# EAGLE schematic SPEEDUINO_WATERPROOF_TC_TRAC (EAGLE 9.1.3)

## Sheet 1 of 7
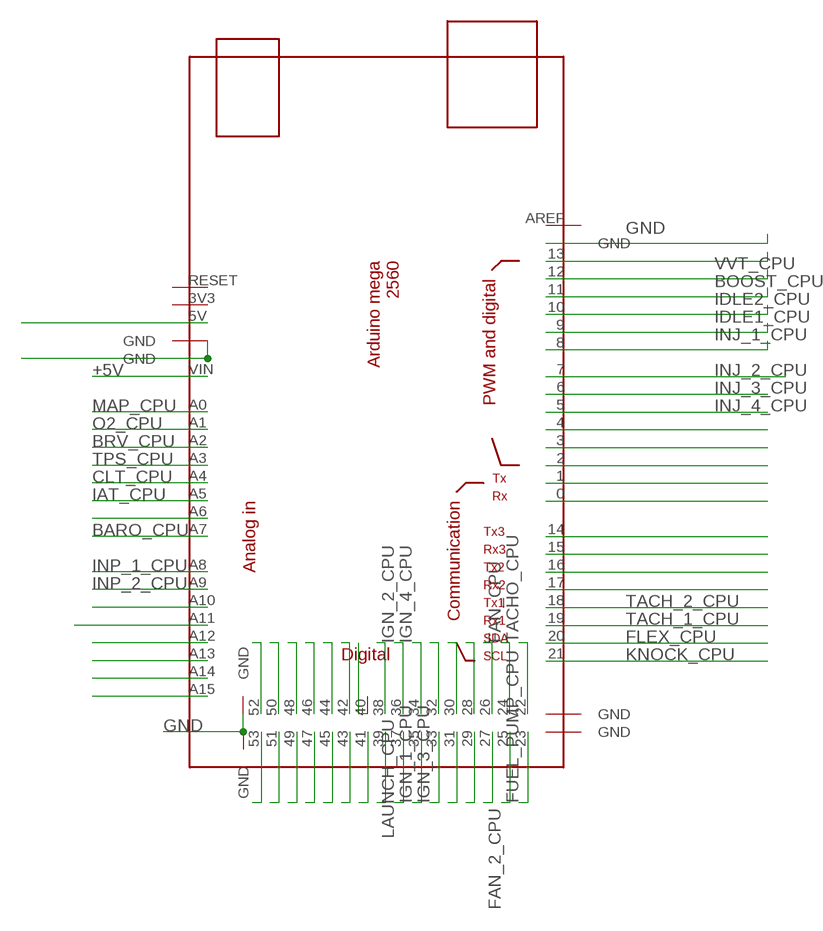
[diagram p0: schematic, sheet 1]

### Parts
U$1  MEGA_DEVICE  [MEGAOUTLINE]

### Nets
+5V: U$1.VIN ; also sheet 2,3,4,5,6
BARO_CPU: U$1.A7
BOOST_CPU: U$1.12 ; also sheet 3
BRV_CPU: U$1.A2 ; also sheet 2
CLT_CPU: U$1.A4 ; also sheet 2,6
FAN_2_CPU: U$1.25 ; also sheet 3
FAN_CPU: U$1.24 ; also sheet 3
FLEX_CPU: U$1.20 ; also sheet 2
FUEL_PUMP_CPU: U$1.23 ; also sheet 3
GND: U$1.GND@1(GND) U$1.GND@6(GND) U$1.GND@7(GND) ; also sheet 2,3,4,5,6
IAT_CPU: U$1.A5 ; also sheet 2
IDLE1_CPU: U$1.9 ; also sheet 3
IDLE2_CPU: U$1.10 ; also sheet 3
IGN_1_CPU: U$1.35 ; also sheet 3
IGN_2_CPU: U$1.36 ; also sheet 3
IGN_3_CPU: U$1.33 ; also sheet 3
IGN_4_CPU: U$1.34 ; also sheet 3
INJ_1_CPU: U$1.8 ; also sheet 3
INJ_2_CPU: U$1.7 ; also sheet 3
INJ_3_CPU: U$1.6 ; also sheet 3
INJ_4_CPU: U$1.5 ; also sheet 3
INP_1_CPU: U$1.A8
INP_2_CPU: U$1.A9 ; also sheet 2
KNOCK_CPU: U$1.21 ; also sheet 2
LAUNCH_CPU: U$1.37 ; also sheet 2
MAP_CPU: U$1.A0 ; also sheet 2,6
N$1: U$1.GND@2(GND) U$1.GND@3(GND)
N$2: U$1.5V
N$3: U$1.52
N$4: U$1.50
N$5: U$1.11
N$6: U$1.48
N$7: U$1.46
N$8: U$1.44
N$9: U$1.42
N$10: U$1.40
N$11: U$1.38
N$12: U$1.4
N$13: U$1.3
N$14: U$1.2
N$15: U$1.1
N$16: U$1.0
N$17: U$1.14
N$18: U$1.15
N$19: U$1.16
N$20: U$1.17
N$25: U$1.A15
N$26: U$1.A14
N$27: U$1.A13
N$28: U$1.A12
N$29: U$1.A11
N$30: U$1.A10
N$34: U$1.A6
N$44: U$1.32
N$45: U$1.30
N$46: U$1.28
N$47: U$1.26
N$50: U$1.53
N$51: U$1.51
N$52: U$1.49
N$53: U$1.47
N$54: U$1.45
N$55: U$1.43
N$56: U$1.41
N$57: U$1.39
N$61: U$1.31
N$62: U$1.29
N$63: U$1.27
O2_CPU: U$1.A1 ; also sheet 2
TACH_1_CPU: U$1.19 ; also sheet 3
TACH_2_CPU: U$1.18 ; also sheet 3
TACHO_CPU: U$1.22 ; also sheet 3,6
TPS_CPU: U$1.A3 ; also sheet 2,6
VVT_CPU: U$1.13 ; also sheet 3
Unconnected: U$1.3V3 U$1.AREF U$1.GND@4(GND) U$1.GND@5(GND) U$1.RESET

## Sheet 2 of 7
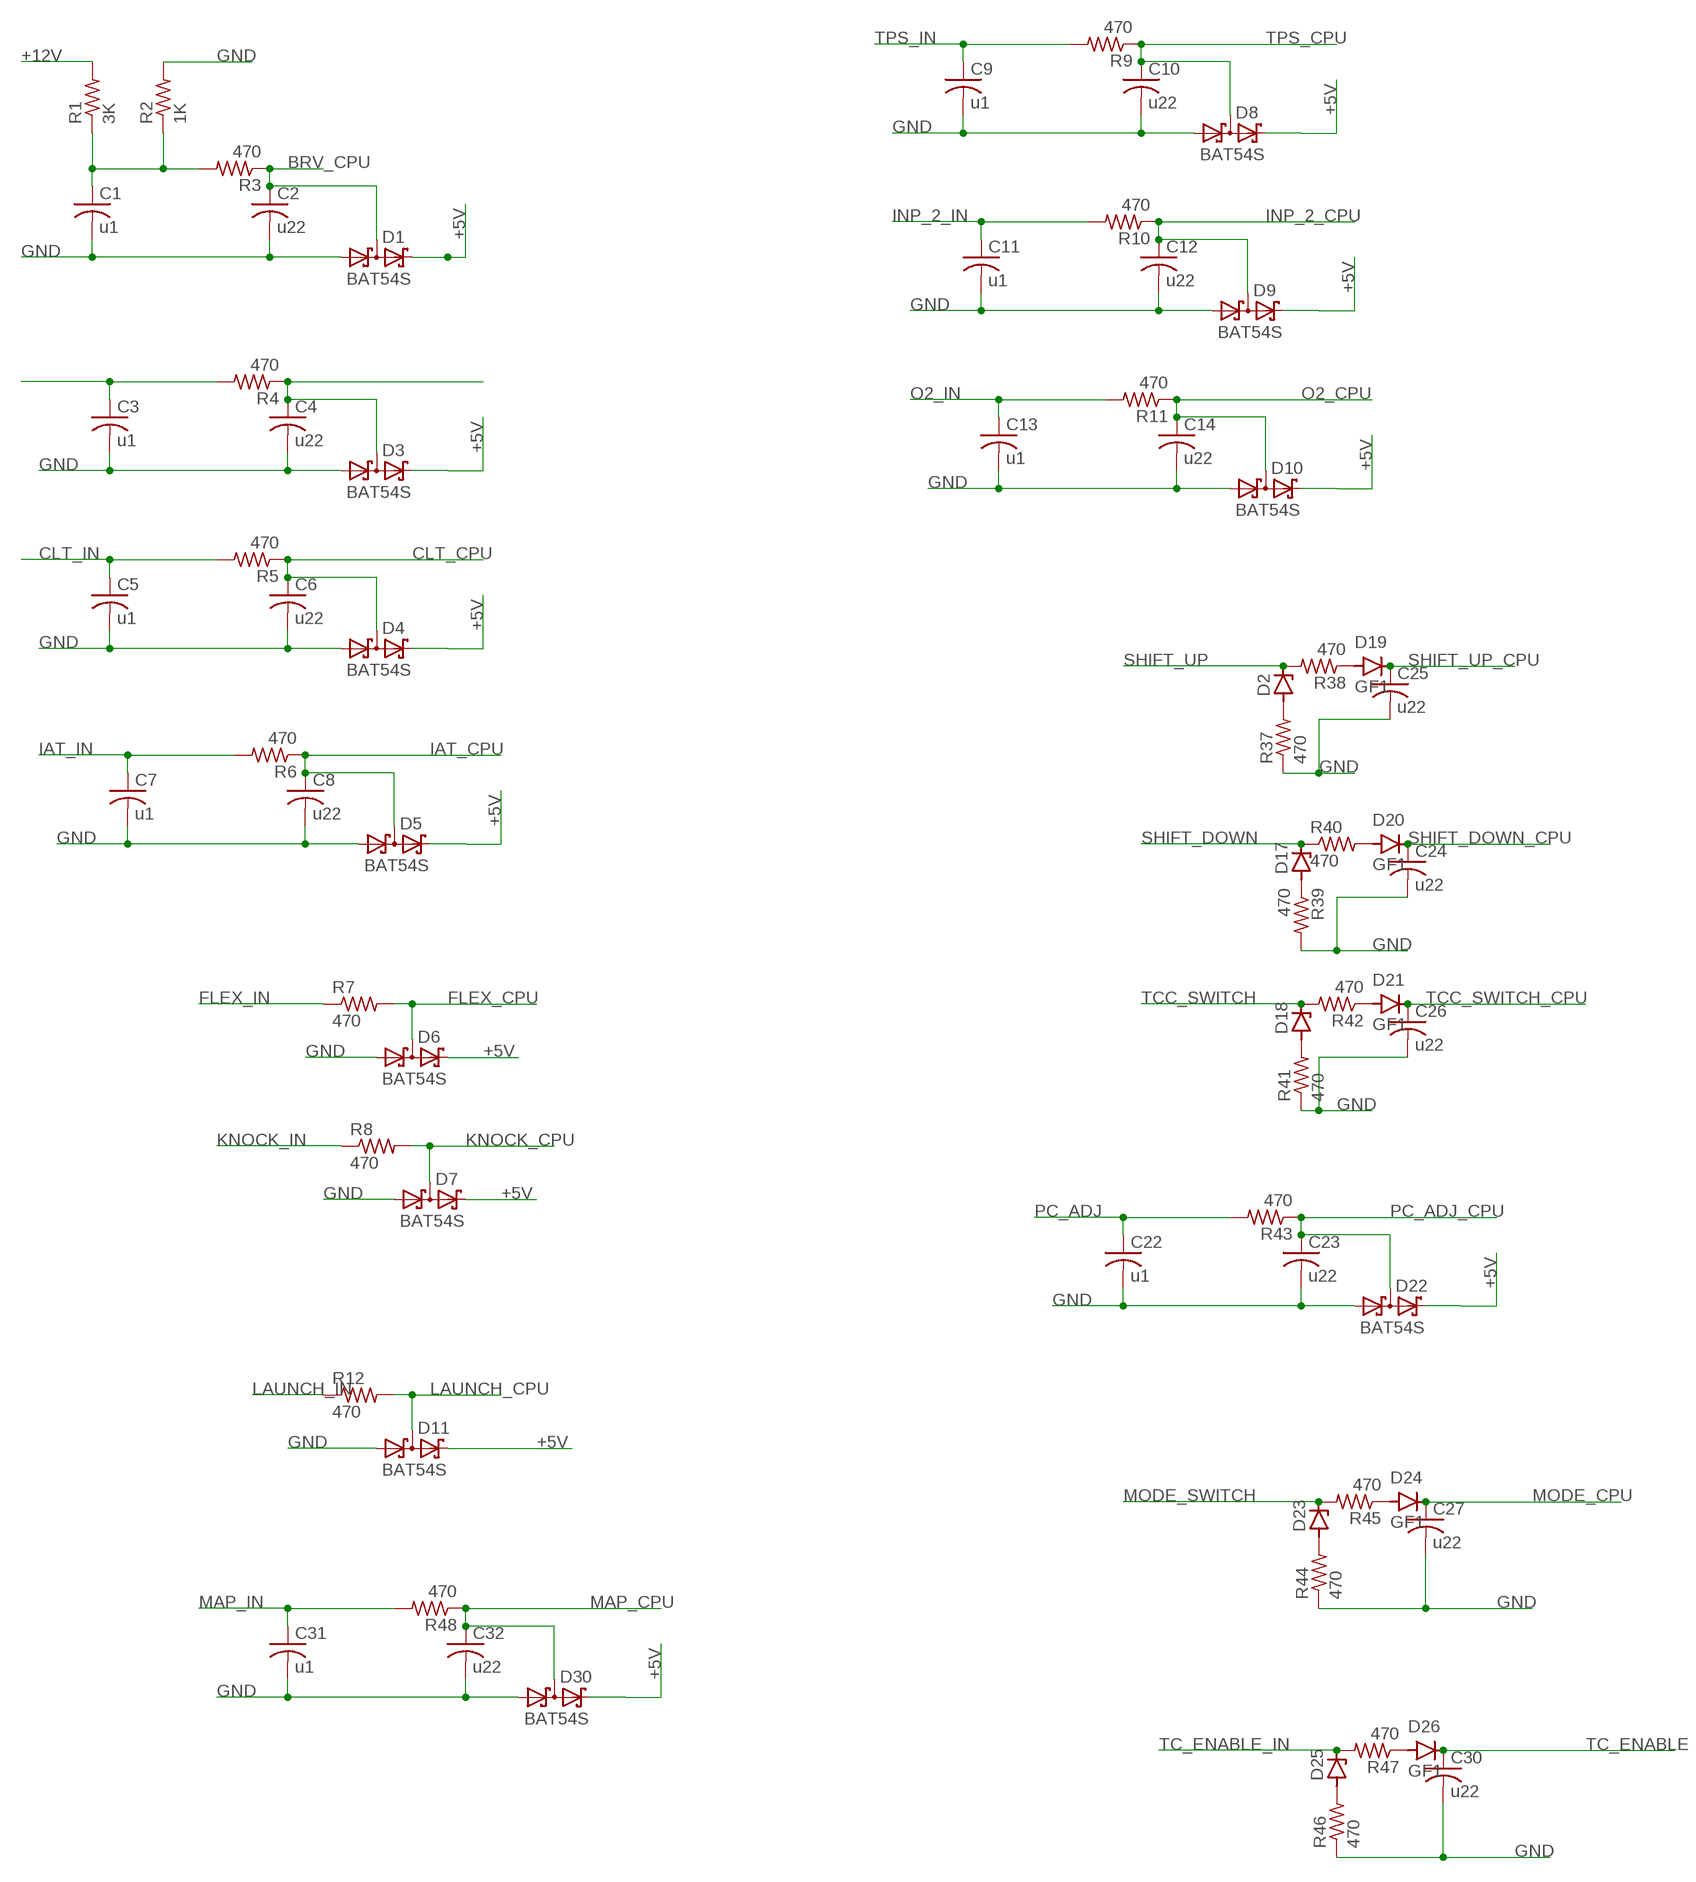
[diagram p1: schematic, sheet 2]

### Parts
C1  u1  C-USC0805  [C0805]
C2  u22  C-USC0805  [C0805]
C3  u1  C-USC0805  [C0805]
C4  u22  C-USC0805  [C0805]
C5  u1  C-USC0805  [C0805]
C6  u22  C-USC0805  [C0805]
C7  u1  C-USC0805  [C0805]
C8  u22  C-USC0805  [C0805]
C9  u1  C-USC0805  [C0805]
C10  u22  C-USC0805  [C0805]
C11  u1  C-USC0805  [C0805]
C12  u22  C-USC0805  [C0805]
C13  u1  C-USC0805  [C0805]
C14  u22  C-USC0805  [C0805]
C22  u1  C-USC0805  [C0805]
C23  u22  C-USC0805  [C0805]
C24  u22  C-USC0805  [C0805]
C25  u22  C-USC0805  [C0805]
C26  u22  C-USC0805  [C0805]
C27  u22  C-USC0805  [C0805]
C30  u22  C-USC0805  [C0805]
C31  u1  C-USC0805  [C0805]
C32  u22  C-USC0805  [C0805]
D1  BAT54S  [SOT23]
D2  ZENER-DIODESOT23  [SOT23]
D3  BAT54S  [SOT23]
D4  BAT54S  [SOT23]
D5  BAT54S  [SOT23]
D6  BAT54S  [SOT23]
D7  BAT54S  [SOT23]
D8  BAT54S  [SOT23]
D9  BAT54S  [SOT23]
D10  BAT54S  [SOT23]
D11  BAT54S  [SOT23]
D17  ZENER-DIODESOT23  [SOT23]
D18  ZENER-DIODESOT23  [SOT23]
D19  GF1  [SMA-DO214AC]
D20  GF1  [SMA-DO214AC]
D21  GF1  [SMA-DO214AC]
D22  BAT54S  [SOT23]
D23  ZENER-DIODESOT23  [SOT23]
D24  GF1  [SMA-DO214AC]
D25  ZENER-DIODESOT23  [SOT23]
D26  GF1  [SMA-DO214AC]
D30  BAT54S  [SOT23]
R1  3K  R-US_R0805  [R0805]
R2  1K  R-US_R0805  [R0805]
R3  470  R-US_R0805  [R0805]
R4  470  R-US_R0805  [R0805]
R5  470  R-US_R0805  [R0805]
R6  470  R-US_R0805  [R0805]
R7  470  R-US_R0603  [R0603]
R8  470  R-US_R0603  [R0603]
R9  470  R-US_R0805  [R0805]
R10  470  R-US_R0805  [R0805]
R11  470  R-US_R0805  [R0805]
R12  470  R-US_R0603  [R0603]
R37  470  R-US_R0805  [R0805]
R38  470  R-US_R0805  [R0805]
R39  470  R-US_R0805  [R0805]
R40  470  R-US_R0805  [R0805]
R41  470  R-US_R0805  [R0805]
R42  470  R-US_R0805  [R0805]
R43  470  R-US_R0805  [R0805]
R44  470  R-US_R0805  [R0805]
R45  470  R-US_R0805  [R0805]
R46  470  R-US_R0805  [R0805]
R47  470  R-US_R0805  [R0805]
R48  470  R-US_R0805  [R0805]

### Nets
+5V: D1.2(K2) D3.2(K2) D4.2(K2) D5.2(K2) D6.2(K2) D7.2(K2) D8.2(K2) D9.2(K2) D10.2(K2) D11.2(K2) D22.2(K2) D30.2(K2) ; also sheet 1,3,4,5,6
+12V: R1.2 ; also sheet 3,4,5
BRV_CPU: C2.1 D1.3(K1A2) R3.1 ; also sheet 1
CLT_CPU: C6.1 D4.3(K1A2) R5.1 ; also sheet 1,6
CLT_IN: C5.1 R5.2 ; also sheet 5
FLEX_CPU: D6.3(K1A2) R7.2 ; also sheet 1
FLEX_IN: R7.1 ; also sheet 5
GND: C1.2 C2.2 C3.2 C4.2 C5.2 C6.2 C7.2 C8.2 C9.2 C10.2 C11.2 C12.2 C13.2 C14.2 C22.2 C23.2 C24.2 C25.2 C26.2 C27.2 C30.2 C31.2 C32.2 D1.1(A1) D3.1(A1) D4.1(A1) D5.1(A1) D6.1(A1) D7.1(A1) D8.1(A1) D9.1(A1) D10.1(A1) D11.1(A1) D22.1(A1) D30.1(A1) R2.2 R37.1 R39.2 R41.1 R44.1 R46.1 ; also sheet 1,3,4,5,6
IAT_CPU: C8.1 D5.3(K1A2) R6.1 ; also sheet 1
IAT_IN: C7.1 R6.2 ; also sheet 5
INP_2_CPU: C12.1 D9.3(K1A2) R10.1 ; also sheet 1
INP_2_IN: C11.1 R10.2
KNOCK_CPU: D7.3(K1A2) R8.2 ; also sheet 1
KNOCK_IN: R8.1 ; also sheet 5,6
LAUNCH_CPU: D11.3(K1A2) R12.2 ; also sheet 1
LAUNCH_IN: R12.1 ; also sheet 5
MAP_CPU: C32.1 D30.3(K1A2) R48.1 ; also sheet 1,6
MAP_IN: C31.1 R48.2
MODE_CPU: C27.1 D24.K(C) ; also sheet 6
MODE_SWITCH: D23.3(C) R45.2 ; also sheet 5
N$21: C1.1 R1.1 R2.1 R3.2
N$22: C3.1 R4.2
N$23: C4.1 D3.3(K1A2) R4.1
N$49: D19.A R38.1
N$58: D2.1(A) R37.2
N$59: D17.1(A) R39.1
N$60: D23.1(A) R44.2
N$64: D25.1(A) R46.2
N$65: D20.A R40.2
N$66: D24.A R45.1
N$67: D18.1(A) R41.2
N$69: D26.A R47.1
N$71: D21.A R42.1
O2_CPU: C14.1 D10.3(K1A2) R11.1 ; also sheet 1
O2_IN: C13.1 R11.2 ; also sheet 5
PC_ADJ: C22.1 R43.2 ; also sheet 5
PC_ADJ_CPU: C23.1 D22.3(K1A2) R43.1 ; also sheet 6
SHIFT_DOWN: D17.3(C) R40.1 ; also sheet 5
SHIFT_DOWN_CPU: C24.1 D20.K(C) ; also sheet 6
SHIFT_UP: D2.3(C) R38.2 ; also sheet 5
SHIFT_UP_CPU: C25.1 D19.K(C) ; also sheet 6
TC_ENABLE: C30.1 D26.K(C) ; also sheet 6
TC_ENABLE_IN: D25.3(C) R47.2 ; also sheet 5
TCC_SWITCH: D18.3(C) R42.2 ; also sheet 5
TCC_SWITCH_CPU: C26.1 D21.K(C) ; also sheet 6
TPS_CPU: C10.1 D8.3(K1A2) R9.1 ; also sheet 1,6
TPS_IN: C9.1 R9.2 ; also sheet 5

## Sheet 3 of 7
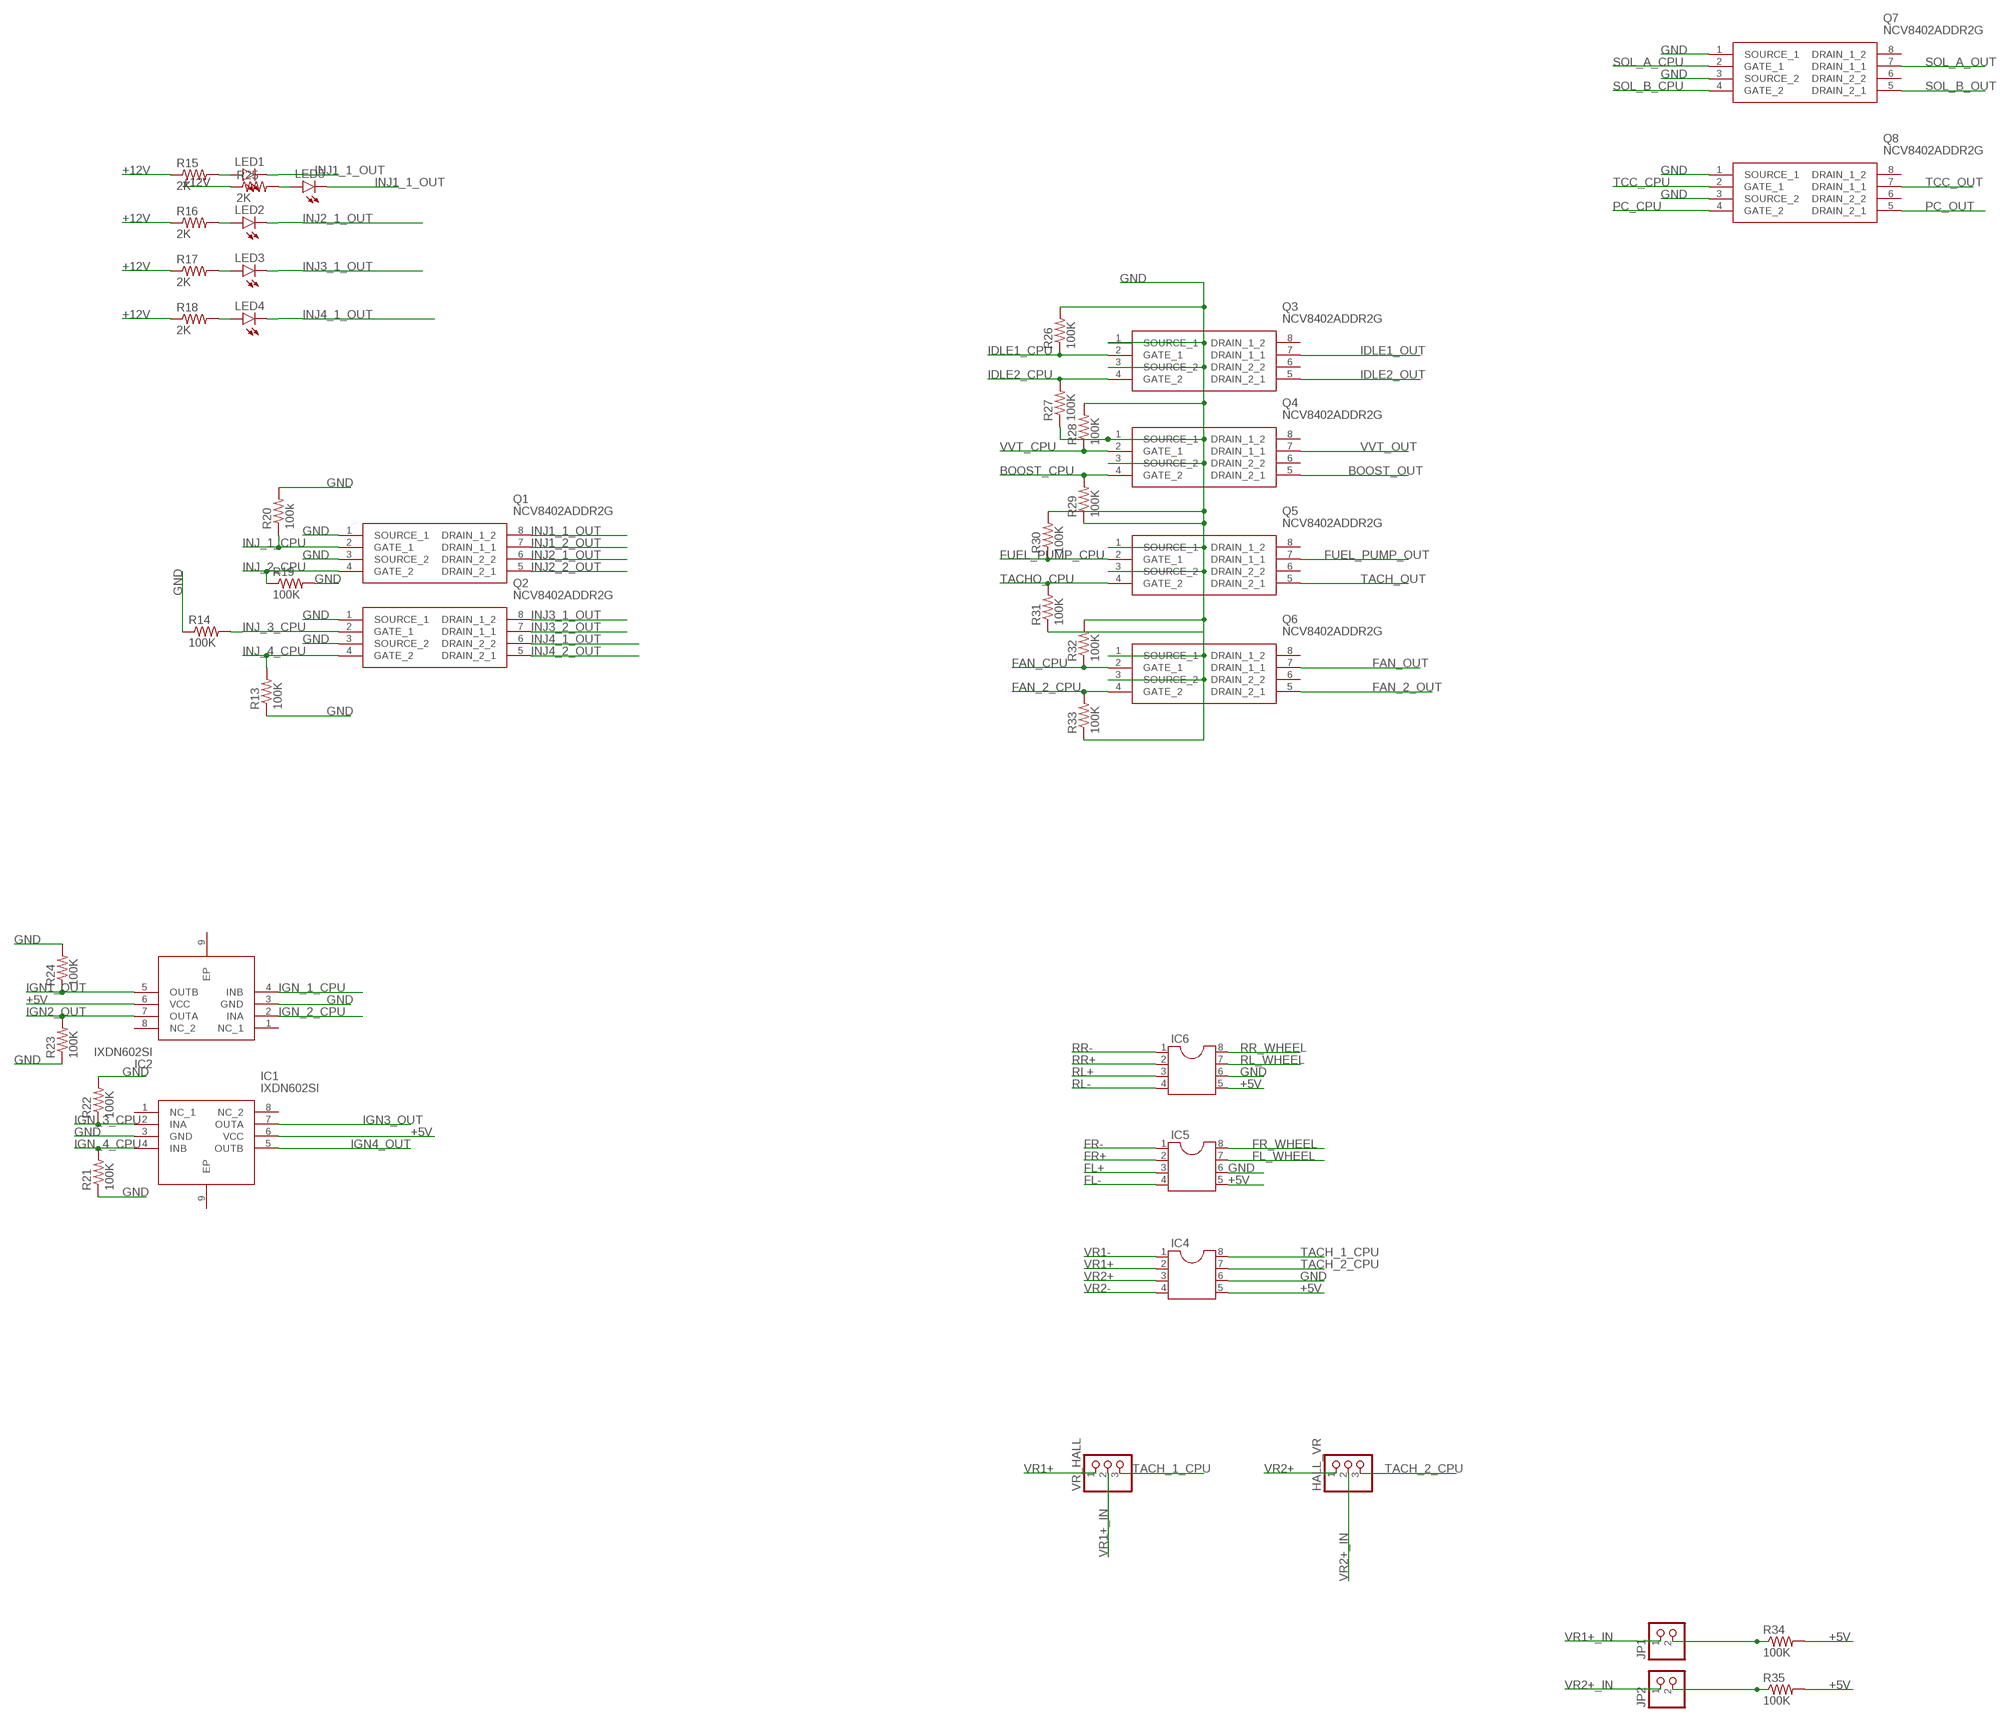
[diagram p2: schematic, sheet 3]

### Parts
HALL_VR  PINHD-1X3  [1X03]
IC1  IXDN602SI  [SOP140P599X142-9N]
IC2  IXDN602SI  [SOP140P599X142-9N]
IC4  DIL8  [DIL08]
IC5  DIL8  [DIL08]
IC6  DIL8  [DIL08]
JP1  PINHD-1X2  [1X02]
JP2  PINHD-1X2  [1X02]
LED1  LEDCHIP-LED0805  [CHIP-LED0805]
LED2  LEDCHIP-LED0805  [CHIP-LED0805]
LED3  LEDCHIP-LED0805  [CHIP-LED0805]
LED4  LEDCHIP-LED0805  [CHIP-LED0805]
LED5  LEDCHIP-LED0805  [CHIP-LED0805]
Q1  NCV8402ADDR2G  [SOIC127P600X175-8N]
Q2  NCV8402ADDR2G  [SOIC127P600X175-8N]
Q3  NCV8402ADDR2G  [SOIC127P600X175-8N]
Q4  NCV8402ADDR2G  [SOIC127P600X175-8N]
Q5  NCV8402ADDR2G  [SOIC127P600X175-8N]
Q6  NCV8402ADDR2G  [SOIC127P600X175-8N]
Q7  NCV8402ADDR2G  [SOIC127P600X175-8N]
Q8  NCV8402ADDR2G  [SOIC127P600X175-8N]
R13  100K  R-US_R0805  [R0805]
R14  100K  R-US_R0805  [R0805]
R15  2K  R-US_R0805  [R0805]
R16  2K  R-US_R0805  [R0805]
R17  2K  R-US_R0805  [R0805]
R18  2K  R-US_R0805  [R0805]
R19  100K  R-US_R0805  [R0805]
R20  100k  R-US_R0805  [R0805]
R21  100K  R-US_R0805  [R0805]
R22  100K  R-US_R0805  [R0805]
R23  100K  R-US_R0805  [R0805]
R24  100K  R-US_R0805  [R0805]
R25  2K  R-US_R0805  [R0805]
R26  100K  R-US_R0805  [R0805]
R27  100K  R-US_R0805  [R0805]
R28  100K  R-US_R0805  [R0805]
R29  100K  R-US_R0805  [R0805]
R30  100K  R-US_R0805  [R0805]
R31  100K  R-US_R0805  [R0805]
R32  100K  R-US_R0805  [R0805]
R33  100K  R-US_R0805  [R0805]
R34  100K  R-US_R0805  [R0805]
R35  100K  R-US_R0805  [R0805]
VR_HALL  PINHD-1X3  [1X03]

### Nets
+5V: IC1.6(VCC) IC2.6(VCC) IC4.5 IC5.5 IC6.5 R34.2 R35.2 ; also sheet 1,2,4,5,6
+12V: R15.1 R16.1 R17.1 R18.1 R25.1 ; also sheet 2,4,5
BOOST_CPU: Q4.4(GATE_2) R29.2 ; also sheet 1
BOOST_OUT: Q4.5(DRAIN_2_1) ; also sheet 5
FAN_2_CPU: Q6.4(GATE_2) R33.2 ; also sheet 1
FAN_2_OUT: Q6.5(DRAIN_2_1)
FAN_CPU: Q6.2(GATE_1) R32.1 ; also sheet 1
FAN_OUT: Q6.7(DRAIN_1_1) ; also sheet 5
FL+: IC5.3 ; also sheet 5
FL-: IC5.4 ; also sheet 5
FL_WHEEL: IC5.7 ; also sheet 6
FR+: IC5.2 ; also sheet 5
FR-: IC5.1 ; also sheet 5
FR_WHEEL: IC5.8 ; also sheet 6
FUEL_PUMP_CPU: Q5.2(GATE_1) R30.1 ; also sheet 1
FUEL_PUMP_OUT: Q5.7(DRAIN_1_1) ; also sheet 5
GND: IC1.3(GND) IC2.3(GND) IC4.6 IC5.6 IC6.6 Q1.1(SOURCE_1) Q1.3(SOURCE_2) Q2.1(SOURCE_1) Q2.3(SOURCE_2) Q3.1(SOURCE_1) Q3.3(SOURCE_2) Q4.1(SOURCE_1) Q4.3(SOURCE_2) Q5.1(SOURCE_1) Q5.3(SOURCE_2) Q6.1(SOURCE_1) Q6.3(SOURCE_2) Q7.1(SOURCE_1) Q7.3(SOURCE_2) Q8.1(SOURCE_1) Q8.3(SOURCE_2) R13.1 R14.1 R19.2 R20.2 R21.1 R22.2 R23.1 R24.2 R26.2 R27.1 R28.2 R29.1 R30.2 R31.1 R32.2 R33.1 ; also sheet 1,2,4,5,6
IDLE1_CPU: Q3.2(GATE_1) R26.1 ; also sheet 1
IDLE1_OUT: Q3.7(DRAIN_1_1) ; also sheet 5
IDLE2_CPU: Q3.4(GATE_2) R27.2 ; also sheet 1
IDLE2_OUT: Q3.5(DRAIN_2_1) ; also sheet 5
IGN1_OUT: IC2.5(OUTB) R24.1 ; also sheet 5
IGN2_OUT: IC2.7(OUTA) R23.2 ; also sheet 5
IGN3_OUT: IC1.7(OUTA) ; also sheet 5
IGN4_OUT: IC1.5(OUTB) ; also sheet 5
IGN_1_CPU: IC2.4(INB) ; also sheet 1
IGN_2_CPU: IC2.2(INA) ; also sheet 1
IGN_3_CPU: IC1.2(INA) R22.1 ; also sheet 1
IGN_4_CPU: IC1.4(INB) R21.2 ; also sheet 1
INJ1_1_OUT: LED1.C LED5.C Q1.8(DRAIN_1_2) ; also sheet 5
INJ1_2_OUT: Q1.7(DRAIN_1_1) ; also sheet 5
INJ2_1_OUT: LED2.C Q1.6(DRAIN_2_2) ; also sheet 5
INJ2_2_OUT: Q1.5(DRAIN_2_1) ; also sheet 5
INJ3_1_OUT: LED3.C Q2.8(DRAIN_1_2) ; also sheet 5
INJ3_2_OUT: Q2.7(DRAIN_1_1) ; also sheet 5
INJ4_1_OUT: LED4.C Q2.6(DRAIN_2_2) ; also sheet 5
INJ4_2_OUT: Q2.5(DRAIN_2_1) ; also sheet 5
INJ_1_CPU: Q1.2(GATE_1) R20.1 ; also sheet 1
INJ_2_CPU: Q1.4(GATE_2) R19.1 ; also sheet 1
INJ_3_CPU: Q2.2(GATE_1) R14.2 ; also sheet 1
INJ_4_CPU: Q2.4(GATE_2) R13.2 ; also sheet 1
N$24: LED2.A R16.2
N$31: LED1.A R15.2
N$35: LED3.A R17.2
N$37: LED4.A R18.2
N$39: LED5.A R25.2
N$42: JP2.2 R35.1
N$43: JP1.2 R34.1
PC_CPU: Q8.4(GATE_2) ; also sheet 6
PC_OUT: Q8.5(DRAIN_2_1) ; also sheet 5
RL+: IC6.3 ; also sheet 5
RL-: IC6.4 ; also sheet 5
RL_WHEEL: IC6.7 ; also sheet 6
RR+: IC6.2 ; also sheet 5
RR-: IC6.1 ; also sheet 5
RR_WHEEL: IC6.8 ; also sheet 6
SOL_A_CPU: Q7.2(GATE_1) ; also sheet 6
SOL_A_OUT: Q7.7(DRAIN_1_1) ; also sheet 5
SOL_B_CPU: Q7.4(GATE_2) ; also sheet 6
SOL_B_OUT: Q7.5(DRAIN_2_1) ; also sheet 5
TACH_1_CPU: IC4.8 VR_HALL.3 ; also sheet 1
TACH_2_CPU: HALL_VR.3 IC4.7 ; also sheet 1
TACH_OUT: Q5.5(DRAIN_2_1) ; also sheet 5
TACHO_CPU: Q5.4(GATE_2) R31.2 ; also sheet 1,6
TCC_CPU: Q8.2(GATE_1) ; also sheet 6
TCC_OUT: Q8.7(DRAIN_1_1) ; also sheet 5
VR1+: IC4.2 VR_HALL.1
VR1+_IN: JP1.1 VR_HALL.2 ; also sheet 5
VR1-: IC4.1 ; also sheet 5
VR2+: HALL_VR.1 IC4.3
VR2+_IN: HALL_VR.2 JP2.1 ; also sheet 5
VR2-: IC4.4 ; also sheet 5
VVT_CPU: Q4.2(GATE_1) R28.1 ; also sheet 1
VVT_OUT: Q4.7(DRAIN_1_1) ; also sheet 5
Unconnected: IC1.1(NC_1) IC1.8(NC_2) IC1.9(EP) IC2.1(NC_1) IC2.8(NC_2) IC2.9(EP) Q3.6(DRAIN_2_2) Q3.8(DRAIN_1_2) Q4.6(DRAIN_2_2) Q4.8(DRAIN_1_2) Q5.6(DRAIN_2_2) Q5.8(DRAIN_1_2) Q6.6(DRAIN_2_2) Q6.8(DRAIN_1_2) Q7.6(DRAIN_2_2) Q7.8(DRAIN_1_2) Q8.6(DRAIN_2_2) Q8.8(DRAIN_1_2)

## Sheet 4 of 7
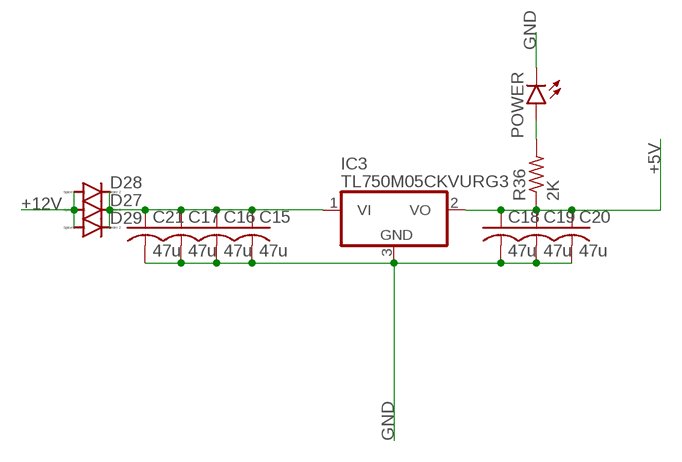
[diagram p3: schematic, sheet 4]

### Parts
C15  47u  C-USC0805  [C0805]
C16  47u  C-USC0805  [C0805]
C17  47u  C-USC0805  [C0805]
C18  47u  C-USC0805  [C0805]
C19  47u  C-USC0805  [C0805]
C20  47u  C-USC0805  [C0805]
C21  47u  C-USC0805  [C0805]
D27  DIODE-SOD123  [SOD123]
D28  DIODE-SOD123  [SOD123]
D29  DIODE-SOD123  [SOD123]
IC3  TL750M05CKVURG3  7824DT  [TO252]
POWER  LEDCHIP-LED0805  [CHIP-LED0805]
R36  2K  R-US_R0805  [R0805]

### Nets
+5V: C18.1 C19.1 C20.1 IC3.2(VO) R36.1 ; also sheet 1,2,3,5,6
+12V: D27.A D28.A D29.A ; also sheet 2,3,5
GND: C15.2 C16.2 C17.2 C18.2 C19.2 C20.2 C21.2 IC3.3(GND) POWER.C ; also sheet 1,2,3,5,6
N$41: C15.1 C16.1 C17.1 C21.1 D27.C D28.C D29.C IC3.1(VI)
N$48: POWER.A R36.2

## Sheet 5 of 7
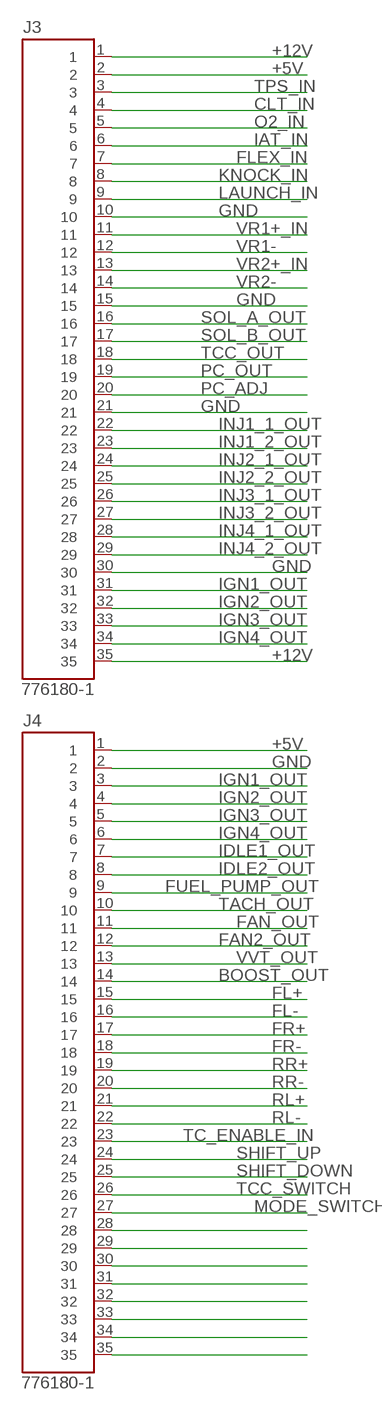
[diagram p4: schematic, sheet 5]

### Parts
J3  776180-1  [TE_776180-1]
J4  776180-1  [TE_776180-1]

### Nets
+5V: J3.2 J4.1 ; also sheet 1,2,3,4,6
+12V: J3.1 J3.35 ; also sheet 2,3,4
BOOST_OUT: J4.14 ; also sheet 3
CLT_IN: J3.4 ; also sheet 2
FAN2_OUT: J4.12
FAN_OUT: J4.11 ; also sheet 3
FL+: J4.15 ; also sheet 3
FL-: J4.16 ; also sheet 3
FLEX_IN: J3.7 ; also sheet 2
FR+: J4.17 ; also sheet 3
FR-: J4.18 ; also sheet 3
FUEL_PUMP_OUT: J4.9 ; also sheet 3
GND: J3.10 J3.15 J3.21 J3.30 J4.2 ; also sheet 1,2,3,4,6
IAT_IN: J3.6 ; also sheet 2
IDLE1_OUT: J4.7 ; also sheet 3
IDLE2_OUT: J4.8 ; also sheet 3
IGN1_OUT: J3.31 J4.3 ; also sheet 3
IGN2_OUT: J3.32 J4.4 ; also sheet 3
IGN3_OUT: J3.33 J4.5 ; also sheet 3
IGN4_OUT: J3.34 J4.6 ; also sheet 3
INJ1_1_OUT: J3.22 ; also sheet 3
INJ1_2_OUT: J3.23 ; also sheet 3
INJ2_1_OUT: J3.24 ; also sheet 3
INJ2_2_OUT: J3.25 ; also sheet 3
INJ3_1_OUT: J3.26 ; also sheet 3
INJ3_2_OUT: J3.27 ; also sheet 3
INJ4_1_OUT: J3.28 ; also sheet 3
INJ4_2_OUT: J3.29 ; also sheet 3
KNOCK_IN: J3.8 ; also sheet 2,6
LAUNCH_IN: J3.9 ; also sheet 2
MODE_SWITCH: J4.27 ; also sheet 2
N$135: J4.28
N$136: J4.29
N$137: J4.30
N$138: J4.31
N$139: J4.32
N$140: J4.33
N$141: J4.34
N$142: J4.35
O2_IN: J3.5 ; also sheet 2
PC_ADJ: J3.20 ; also sheet 2
PC_OUT: J3.19 ; also sheet 3
RL+: J4.21 ; also sheet 3
RL-: J4.22 ; also sheet 3
RR+: J4.19 ; also sheet 3
RR-: J4.20 ; also sheet 3
SHIFT_DOWN: J4.25 ; also sheet 2
SHIFT_UP: J4.24 ; also sheet 2
SOL_A_OUT: J3.16 ; also sheet 3
SOL_B_OUT: J3.17 ; also sheet 3
TACH_OUT: J4.10 ; also sheet 3
TC_ENABLE_IN: J4.23 ; also sheet 2
TCC_OUT: J3.18 ; also sheet 3
TCC_SWITCH: J4.26 ; also sheet 2
TPS_IN: J3.3 ; also sheet 2
VR1+_IN: J3.11 ; also sheet 3
VR1-: J3.12 ; also sheet 3
VR2+_IN: J3.13 ; also sheet 3
VR2-: J3.14 ; also sheet 3
VVT_OUT: J4.13 ; also sheet 3

## Sheet 6 of 7
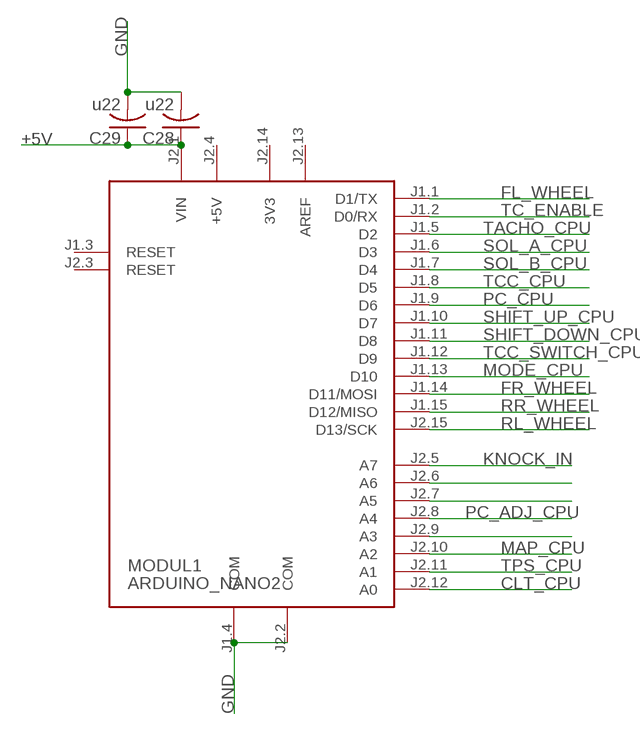
[diagram p5: schematic, sheet 6]

### Parts
C28  u22  C-USC0805  [C0805]
C29  u22  C-USC0805  [C0805]
MODUL1  ARDUINO_NANO2  [ARDUINO_NANO2]

### Nets
+5V: C28.1 C29.1 MODUL1.J2.1(VIN) ; also sheet 1,2,3,4,5
CLT_CPU: MODUL1.J2.12(A0) ; also sheet 1,2
FL_WHEEL: MODUL1.J1.1(D1/TX) ; also sheet 3
FR_WHEEL: MODUL1.J1.14(D11/MOSI) ; also sheet 3
GND: C28.2 C29.2 MODUL1.J1.4(COM) MODUL1.J2.2(COM) ; also sheet 1,2,3,4,5
KNOCK_IN: MODUL1.J2.5(A7) ; also sheet 2,5
MAP_CPU: MODUL1.J2.10(A2) ; also sheet 1,2
MODE_CPU: MODUL1.J1.13(D10) ; also sheet 2
N$76: MODUL1.J2.7(A5)
N$77: MODUL1.J2.6(A6)
PC_ADJ_CPU: MODUL1.J2.8(A4) ; also sheet 2
PC_CPU: MODUL1.J1.9(D6) ; also sheet 3
RL_WHEEL: MODUL1.J2.15(D13/SCK) ; also sheet 3
RR_WHEEL: MODUL1.J1.15(D12/MISO) ; also sheet 3
SHIFT_DOWN_CPU: MODUL1.J1.11(D8) ; also sheet 2
SHIFT_UP_CPU: MODUL1.J1.10(D7) ; also sheet 2
SOL_A_CPU: MODUL1.J1.6(D3) ; also sheet 3
SOL_B_CPU: MODUL1.J1.7(D4) ; also sheet 3
TACHO_CPU: MODUL1.J1.5(D2) MODUL1.J2.9(A3) ; also sheet 1,3
TC_ENABLE: MODUL1.J1.2(D0/RX) ; also sheet 2
TCC_CPU: MODUL1.J1.8(D5) ; also sheet 3
TCC_SWITCH_CPU: MODUL1.J1.12(D9) ; also sheet 2
TPS_CPU: MODUL1.J2.11(A1) ; also sheet 1,2
Unconnected: MODUL1.J1.3(RESET) MODUL1.J2.3(RESET)

## Sheet 7 of 7

## Power pins joined to a net without a drawn wire
3V3: MODUL1.J2.14(3V3)
+5V: MODUL1.J2.4(+5V)
AREF: MODUL1.J2.13(AREF)

## Library data of the parts
C1-C32 = rcl:C-US: CAPACITOR, American symbol; SPICEPREFIX: C
D1 D3-D11 D22 D30 = BAT54S:BAT54S: Schottky barrier (double) diodes Planar Schottky barrier diodes encapsulated in a SOT23 small plastic SMD package. Single diodes and double diodes with different pinning are available. AAL Eindhoven MK; AVAILABILITY: Unavailable; DESCRIPTION: Diode Array 1 Pair Series Connection Schottky 30V 200mA Surface Mount TO-236-3, SC-59, SOT-23-3; MF: ON Semiconductor; MP: BAT54S; PACKAGE: SOT-23-3 ON Semiconductor; PRICE: None
D2 D17 D18 D23 D25 = diode:ZENER-DIODE: Z-Diode
D19-D21 D24 D26 = diode:GF1: DIODE
D27-D29 = diode:DIODE-: DIODE
HALL_VR VR_HALL = pinhead:PINHD-1X3: PIN HEADER
IC1 IC2 = IXDN602SI:IXDN602SI: 2-Ampere Dual Low-Side Ultrafast MOSFET Drivers Source: Datasheet <http://www.ixysic.com/home/pdfs.nsf/www/IXD_602.pdf/$file/IXD_602.pdf>; DESCRIPTION: 2-Ampere Dual Low-Side Ultrafast MOSFET Drivers; HEIGHT: 1.422mm; MANUFACTURER_NAME: IXYS SEMICONDUCTOR; MANUFACTURER_PART_NUMBER: IXDN602SI; MOUSER_PART_NUMBER: 849-IXDN602SI; MOUSER_PRICE-STOCK: https://www.mouser.com/Search/Refine.aspx?Keyword=849-IXDN602SI
IC3 = linear:78*: Positive VOLTAGE REGULATOR Source: http://cache.national.com/ds/LM/LM78L05.pdf http://www.fairchildsemi.com/ds/LM/LM7805.pdf
IC4-IC6 = ic-package:DIL8: Dual In Line / Socket
J3 J4 = 776180-1:776180-1: Conn Rectangular HDR 35 POS Solder RA Thru-Hole Automotive; MANUFACTURER: TE CONNECTIVITY; PARTREV: H7; STANDARD: STANDARED RECOMENDATION
JP1 JP2 = pinhead:PINHD-1X2: PIN HEADER
LED1-LED5 POWER = led:LED: LED OSRAM: - CHIPLED LG R971, LG N971, LY N971, LG Q971, LY Q971, LO R971, LY R971 LH N974, LH R974 LS Q976, LO Q976, LY Q976 LO Q996 - Hyper CHIPLED LW Q18S LB Q993, LB Q99A, LB R99A - SideLED LS A670, LO A670, LY A670, LG A670, LP A670 LB A673, LV A673, LT A673, LW A673 LH A674 LY A675 LS A676, LA A676, LO A676, LY A676, LW A676 LS A679, LY A679, LG A679 - Hyper Micro SIDELED® LS Y876, LA Y876, LO Y876, LY Y876 LT Y87S - SmartLED LW L88C, LW L88S LB L89C, LB L89S, LG L890 LS L89K, LO L89K, LY L89K LS L896, LA L896, LO L896, LY L896 - TOPLED LS T670, LO T670, LY T670, LG T670, LP T670 LSG T670, LSP T670, LSY T670, LOP T670, LYG T670 LG T671, LOG T671, LSG T671 LB T673, LV T673, LT T673, LW T673 LH T674 LS T676, LA T676, LO T676, LY T676, LB T676, LH T676, LSB T676, LW T676 LB T67C, LV T67C, LT T67C, LS T67K, LO T67K, LY T67K, LW E67C LS E67B, LA E67B, LO E67B, LY E67B, LB E67C, LV E67C, LT E67C LW T67C LS T679, LY T679, LG T679 LS T770, LO T770, LY T770, LG T770, LP T770 LB T773, LV T773, LT T773, LW T773 LH T774 LS E675, LA E675, LY E675, LS T675 LS T776, LA T776, LO T776, LY T776, LB T776 LHGB T686 LT T68C, LB T68C - Hyper Mini TOPLED® LB M676 - Mini TOPLED Santana® LG M470 LS M47K, LO M47K, LY M47K Source: http://www.osram.convergy.de LUXEON: - LUMILED® LXK2-PW12-R00, LXK2-PW12-S00, LXK2-PW14-U00, LXK2-PW14-V00 LXK2-PM12-R00, LXK2-PM12-S00, LXK2-PM14-U00 LXK2-PE12-Q00, LXK2-PE12-R00, LXK2-PE12-S00, LXK2-PE14-T00, LXK2-PE14-U00 LXK2-PB12-K00, LXK2-PB12-L00, LXK2-PB12-M00, LXK2-PB14-N00, LXK2-PB14-P00, LXK2-PB14-Q00 LXK2-PR12-L00, LXK2-PR12-M00, LXK2-PR14-Q00, LXK2-PR14-R00 LXK2-PD12-Q00, LXK2-PD12-R00, LXK2-PD12-S00 LXK2-PH12-R00, LXK2-PH12-S00 LXK2-PL12-P00, LXK2-PL12-Q00, LXK2-PL12-R00 Source: www.luxeon.com KINGBRIGHT: KA-3528ASYC Source: www.kingbright.com
MODUL1 = arduino:ARDUINO_NANO2: Arduino Nano2 Auto generated by modulcreator.ulp \;; ANZAHL: 2; MODUL: TRUE; STECKX0: -76200; STECKX1: 76200; STECKY0: 177800; STECKY1: 177800
Q1-Q8 = NCV8402ADDR2G:NCV8402ADDR2G: Dual Self-Protected N-Channel Power MOSFET Source: Datasheet <https://componentsearchengine.com/Datasheets/1/NCV8402ADDR2G.pdf>; DESCRIPTION: Dual Self-Protected N-Channel Power MOSFET; HEIGHT: 1.75mm; MANUFACTURER_NAME: ON Semiconductor; MANUFACTURER_PART_NUMBER: NCV8402ADDR2G; MOUSER_PART_NUMBER: 863-NCV8402ADDR2G; MOUSER_PRICE-STOCK: https://www.mouser.com/Search/Refine.aspx?Keyword=863-NCV8402ADDR2G
R1-R48 = rcl:R-US_: RESISTOR, American symbol; SPICEPREFIX: R
U$1 = ArduinoMegaOutline:MEGA_DEVICE: mega card as device